# Altium schematic sheet PowerSupply.SchDoc
size A4
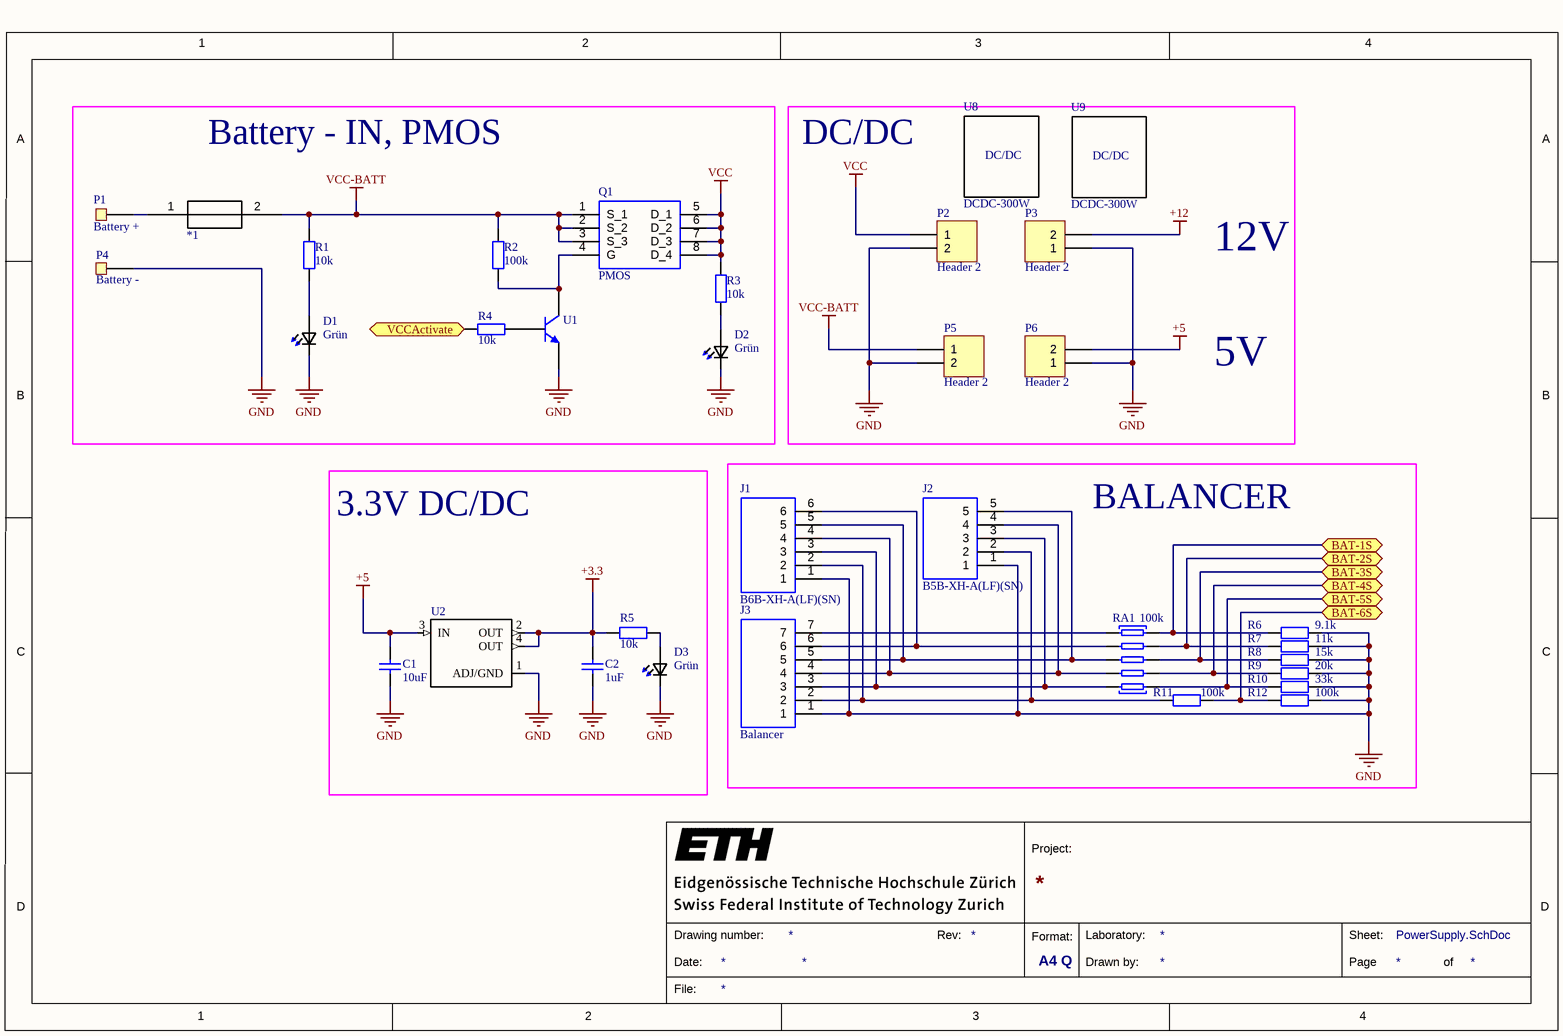
[diagram p0: PowerSupply.SchDoc]

## Parts
*1  Fuse  [FUSE-3586KTR]  (value not drawn)
C1  10uF  [CAP_0805i_2012m -L]
C2  1uF  [CAP_0805i_2012m -L]
D1  Grün  [*0603]
D2  Grün  [*0603]
D3  Grün  [*0603]
J1  B6B-XH-A(LF)(SN)  [SHDR6W64P0X250_1X6_1740X575X700P]
J2  B5B-XH-A(LF)(SN)  [SHDR5W64P0X250_1X5_1490X575X700P]
J3  Balancer  [SHDR7W64P0X250_1X7_1990X575X700P]
P1  Battery +  [PIN1]
P2  Header 2  [3.5MM Phoenix Contact 1984617]
P3  Header 2  [3.5MM Phoenix Contact 1984617]
P4  Battery -  [PIN1]
P5  Header 2  [3.5MM Phoenix Contact 1984617]
P6  Header 2  [3.5MM Phoenix Contact 1984617]
Q1  PMOS  [SIS862DNT1GE3]
R1  10k  [RES_0805i_2012m -N]
R2  100k  [RES_0805i_2012m -N]
R3  10k  [RES_0805i_2012m -N]
R4  10k  [RES_0805i_2012m -N]
R5  10k  [RES_0805i_2012m -N]
R6  9.1k  [RES_0805i_2012m -N]
R7  11k  [RES_0805i_2012m -N]
R8  15k  [RES_0805i_2012m -N]
R9  20k  [RES_0805i_2012m -N]
R10  33k  [RES_0805i_2012m -N]
R11  100k  [RES_0805i_2012m -N]
R12  100k  [RES_0805i_2012m -N]
RA1  100k  [*SIP-10]
U1  Part Number: MMBT3904-7-F  [SOT-23-M]  (value not drawn)
U2  AZ1117EH-3.3TRG1  [*SOT230P700X180-4N]  (value not drawn)
U8  DCDC-300W  [DCDC-300W]
U9  DCDC-300W  [DCDC-300W]

## Blocks framed on the sheet
Battery - IN, PMOS: *1 D1 D2 P1 P4 Q1 R1-R4 U1
3.3V DC/DC: C1 C2 D3 R5 U2
BALANCER: J1-J3 R6-R12 RA1

## Ports
BAT-1S (bidir), BAT-2S (bidir), BAT-3S (bidir), BAT-4S (bidir), BAT-5S (bidir), BAT-6S (bidir), VCCActivate (bidir)

## Nets
+3.3: C2.2 R5.2 U2.2(OUT) U2.4(OUT)
+5: C1.2 P6.2 U2.3(IN)
+12: P3.2
GND: C1.1 C2.1 D1.1(K2) D2.1(K2) D3.1(K2) J1.1 J2.1 J3.1 P2.2 P3.1 P4.1 P5.2 P6.1 R6.1 R7.1 R8.1 R9.1 R10.1 R12.1 U1.2(E) U2.1(ADJ/GND)
VCC: P2.1 Q1.5(D_1) Q1.6(D_2) Q1.7(D_3) Q1.8(D_4) R3.2
VCC-BATT: *1.2 P5.1 Q1.1(S_1) Q1.2(S_2) Q1.3(S_3) R1.2 R2.2
BAT-1S: R6.2 RA1.2 ; port BAT-1S
BAT-2S: R7.2 RA1.4 ; port BAT-2S
BAT-3S: R8.2 RA1.6 ; port BAT-3S
BAT-4S: R9.2 RA1.8 ; port BAT-4S
BAT-5S: R10.2 RA1.10 ; port BAT-5S
BAT-6S: R11.1 R12.2 ; port BAT-6S
VCCActivate: R4.2 ; port VCCActivate
Net*1_1: *1.1 P1.1
NetD1_2: D1.2(A2) R1.1
NetD2_2: D2.2(A2) R3.1
NetD3_2: D3.2(A2) R5.1
NetJ1_2: J1.2 J2.2 J3.2 R11.2
NetJ1_3: J1.3 J2.3 J3.3 RA1.9
NetJ1_4: J1.4 J2.4 J3.4 RA1.7
NetJ1_5: J1.5 J2.5 J3.5 RA1.5
NetJ1_6: J1.6 J3.6 RA1.3
NetJ3_7: J3.7 RA1.1
NetQ1_4: Q1.4(G) R2.1 U1.3(C)
NetR4_1: R4.1 U1.1(B)

## Notes on the sheet
- DC/DC
- 12V
- 5V
- 1
- 2
- 3
- 4
- A
- B
- C
- Project:
- D
- Date:
- Drawing number:
- Rev:
- Format:
- A4 Q
- Drawn by:
- Laboratory:
- Page
- Sheet:
- of
- File:
- (in symbol DCDC-300W) DC/DC

## Library data of the parts
C1 C2 = Cap: capacitor
D1-D3 = LTST-C191KGKT: / LED; SMD; 0603; grün; 35mcd; 1.6x0.8x0.55mm; 130Â°; 2Ã·2.V; 20mA /; MF: Lite-On Inc.; Digi-Key_Purchase_URL: https://www.digikey.ch/product-detail/de/lite-on-inc/LTST-C191KGKT/160-1446-1-ND/386834; SnapEDA_Link: https://www.snapeda.com/parts/LTST-C191KFKT/Lite-On%20Inc./view-part/?ref=snap; MP: LTST-C191KGKT; Digi-Key_Part_Number: 160-1446-1-ND; Package: 0603 Lite-On; Value: *
J1 = B6B-XH-A(LF)(SN): XH connector, 6 way; Manufacturer_Name: JST (JAPAN SOLDERLESS TERMINALS); Geometry.Height: 7mm; Manufacturer_Part_Number: B6B-XH-A(LF)(SN); Mouser Part Number: *; Mouser Price/Stock: *; RS Part Number: 8201563P; RS Price/Stock: http://uk.rs-online.com/web/p/products/8201563P; Datasheet Link: http://www.jst-mfg.com/product/pdf/eng/eXH.pdf
J2 = B5B-XH-A(LF)(SN): XH connector, 5 way; Manufacturer_Name: JST (JAPAN SOLDERLESS TERMINALS); Geometry.Height: 7mm; Manufacturer_Part_Number: B5B-XH-A(LF)(SN); Mouser Part Number: *; Mouser Price/Stock: *; RS Part Number: 8201560P; RS Price/Stock: http://uk.rs-online.com/web/p/products/8201560P; Datasheet Link: http://www.jst-mfg.com/product/pdf/eng/eXH.pdf
J3 = B7B-XH-A(LF)(SN): Shrouded hdr,XH,2.5mm pitch,straight,7w JST XH Series, 2.5mm Pitch 7 Way 1 Row Straight PCB Header, Solder Termination, 3A; Manufacturer_Name: JST (JAPAN SOLDERLESS TERMINALS); Geometry.Height: 7mm; Manufacturer_Part_Number: B7B-XH-A(LF)(SN); Mouser Part Number: *; Mouser Price/Stock: *; RS Part Number: 8201567P; RS Price/Stock: http://uk.rs-online.com/web/p/products/8201567P; Datasheet Link: http://www.jst-mfg.com/product/pdf/eng/eXH.pdf
P1 P4 = Pad: Single Pad or Testpoint
P2 P3 P5 P6 = Header 2: Header, 2-Pin
Q1 = SI7615ADN-T1-GE3: P-Channel MOSFET, 35 A, 20 V, 8-Pin PowerPAK 1212 Vishay; Allied_Number: 70459567; Manufacturer_Name: Vishay; Manufacturer_Part_Number: SI7615ADN-T1-GE3; Mouser Part Number: 78-SI7615ADN-T1-GE3; Mouser Price/Stock: https://www.mouser.com/Search/Refine.aspx?Keyword=78-SI7615ADN-T1-GE3; RS Part Number: 7879248; RS Price/Stock: https://uk.rs-online.com/web/p/products/7879248; Allied Price/Stock: https://www.alliedelec.com/siliconix-vishay-si7615adn-t1-ge3/70459567/; Datasheet Link: https://www.vishay.com/docs/62667/si7615adn.pdf
R1-R12 = Res: Resistor
RA1 = Res Array  5: Isolated Resistor Network
U1 = MMBT3904-7-F: No Description Available; Vendor: Diodes Inc; Built_By: EMA_UL_Team; Manufacturer_Part_Number: MMBT3904-7-F; Copyright: Copyright (C) 2018 Accelerated Designs. All rights reserved; RefDes: RefDes; Type: DEV; Value: Value
U2 = AZ1117EH-3.3TRG1: Ldo.Vreg Pos 3, 3v 1a Sot223; MF: Diodes Inc.; Package: SOT-223 Diodes Inc.; Digi-Key_Purchase_URL: https://www.digikey.ch/product-detail/en/diodes-incorporated/AZ1117EH-3.3TRG1/AZ1117EH-3.3TRG1DICT-ND/5001336?utm_source=snapeda&utm_medium=aggregator&utm_campaign=symbol; MP: AZ1117EH-3.3TRG1; SnapEDA_Link: https://www.snapeda.com/parts/AZ1117EH-3.3TRG1/Diodes%20Inc./view-part/?ref=snap; Digi-Key_Part_Number: AZ1117EH-3.3TRG1DICT-ND; Value: *
U8 U9 = DCDC-300W: 6-36V 20A